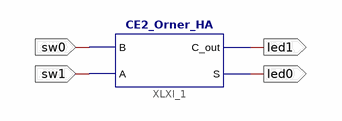
[diagram p0: schematic sheet 1]
// Xilinx ISE schematic CE2_Orner_Top.sch (spartan3e) as structural Verilog: 1 symbols, 4 ports
module CE2_Orner_Top (
  input  sw1,
  input  sw0,
  output led1,
  output led0
);

  CE2_Orner_HA XLXI_1 (.B(sw0), .A(sw1), .C_out(led1), .S(led0));
endmodule
